# Altium schematic sheet JackNoiDenChop.SchDoc
size A
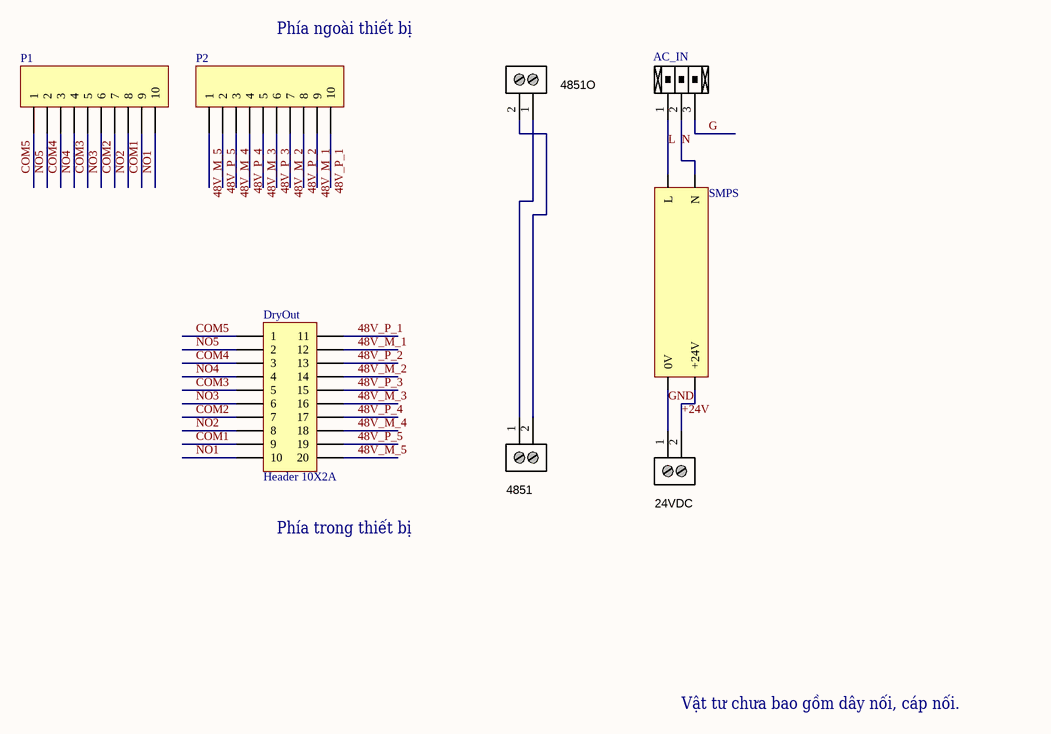
[diagram p0: JackNoiDenChop.SchDoc]

## Parts
24VDC  Giắc xanh 5.08mm  [2P_PCB1]  (value not drawn)
4851  Giắc xanh 5.08mm  [2P_PCB1]  (value not drawn)
4851O  Giắc xanh 5.08mm  [2P_PCB1]  (value not drawn)
AC_IN  Giăc xanh 3 chân, khoảng cách chân 200mil/5.08mm  [3P_ScrewTerm_200mil]  (value not drawn)
DryOut  Header 10X2A  [HDR2X10_CEN]
P1  Giắc xanh 10 chân, khoảng cách chân 5.08mm  [10P_200mil]  (value not drawn)
P2  Giắc xanh 10 chân, khoảng cách chân 5.08mm  [10P_200mil]  (value not drawn)
SMPS  Bộ nguồn xung AC-DC 24V/1.3A, MEANWELL IRM30-24  (value not drawn)

## Nets
48V_M_1: DryOut.12 P2.9
48V_M_2: DryOut.14 P2.7
48V_M_3: DryOut.16 P2.5
48V_M_4: DryOut.18 P2.3
48V_M_5: DryOut.20 P2.1
48V_P_1: DryOut.11 P2.10
48V_P_2: DryOut.13 P2.8
48V_P_3: DryOut.15 P2.6
48V_P_4: DryOut.17 P2.4
48V_P_5: DryOut.19 P2.2
+24V: 24VDC.2 SMPS.3(+24V)
COM1: DryOut.9 P1.9
COM2: DryOut.7 P1.7
COM3: DryOut.5 P1.5
COM4: DryOut.3 P1.3
COM5: DryOut.1 P1.1
G: AC_IN.3
GND: 24VDC.1 SMPS.4(0V)
L: AC_IN.1 SMPS.2(L)
N: AC_IN.2 SMPS.1(N)
NO1: DryOut.10 P1.10
NO2: DryOut.8 P1.8
NO3: DryOut.6 P1.6
NO4: DryOut.4 P1.4
NO5: DryOut.2 P1.2
Net4851_1: 4851.1 4851O.1
Net4851_2: 4851.2 4851O.2

## Notes on the sheet
- Phía ngoài thiết bị
- Phía trong thiết bị
- Vật tư chưa bao gồm dây nối, cáp nối.

## Library data of the parts
24VDC 4851 4851O = 2P_ScrewTerm_90S_3.81MM: Terminal Block Screw Type THT 2-Position 3.81mm pitch; Manufacturer 1: Tyco Electronics; Manufacturer Part Number 1: 1776113-2; Value: 2 position; Pitch: 0.150" (3.81mm); Positions Per Level: 2; Package / Case: Side Entry; 3.81mm pitch; Category: Connectors Interconnects; Color: Black; Supplier 1: Digi-Key; Supplier Part Number 1: A97976-ND; vl: Giắc xanh 5.08mm
AC_IN = 3P_ScrewTerm_200mil: Terminal Block THT 3-Position header 5.08mm/200mil pitch; vl: Giăc xanh 3 chân, khoảng cách chân 200mil/5.08mm
DryOut = Header 10X2A: Header, 10-Pin, Dual row; LatestRevisionDate: 17-Jul-2002; LatestRevisionNote: Re-released for DXP Platform.; Publisher: Altium Limited
P1 P2 = MHDR1X10: Header, 10-Pin; LatestRevisionDate: 17-Jul-2002; LatestRevisionNote: Re-released for DXP Platform.; Publisher: Altium Limited
SMPS = SMPS: vl: Bộ nguồn xung AC-DC 24V/1.3A, MEANWELL IRM30-24